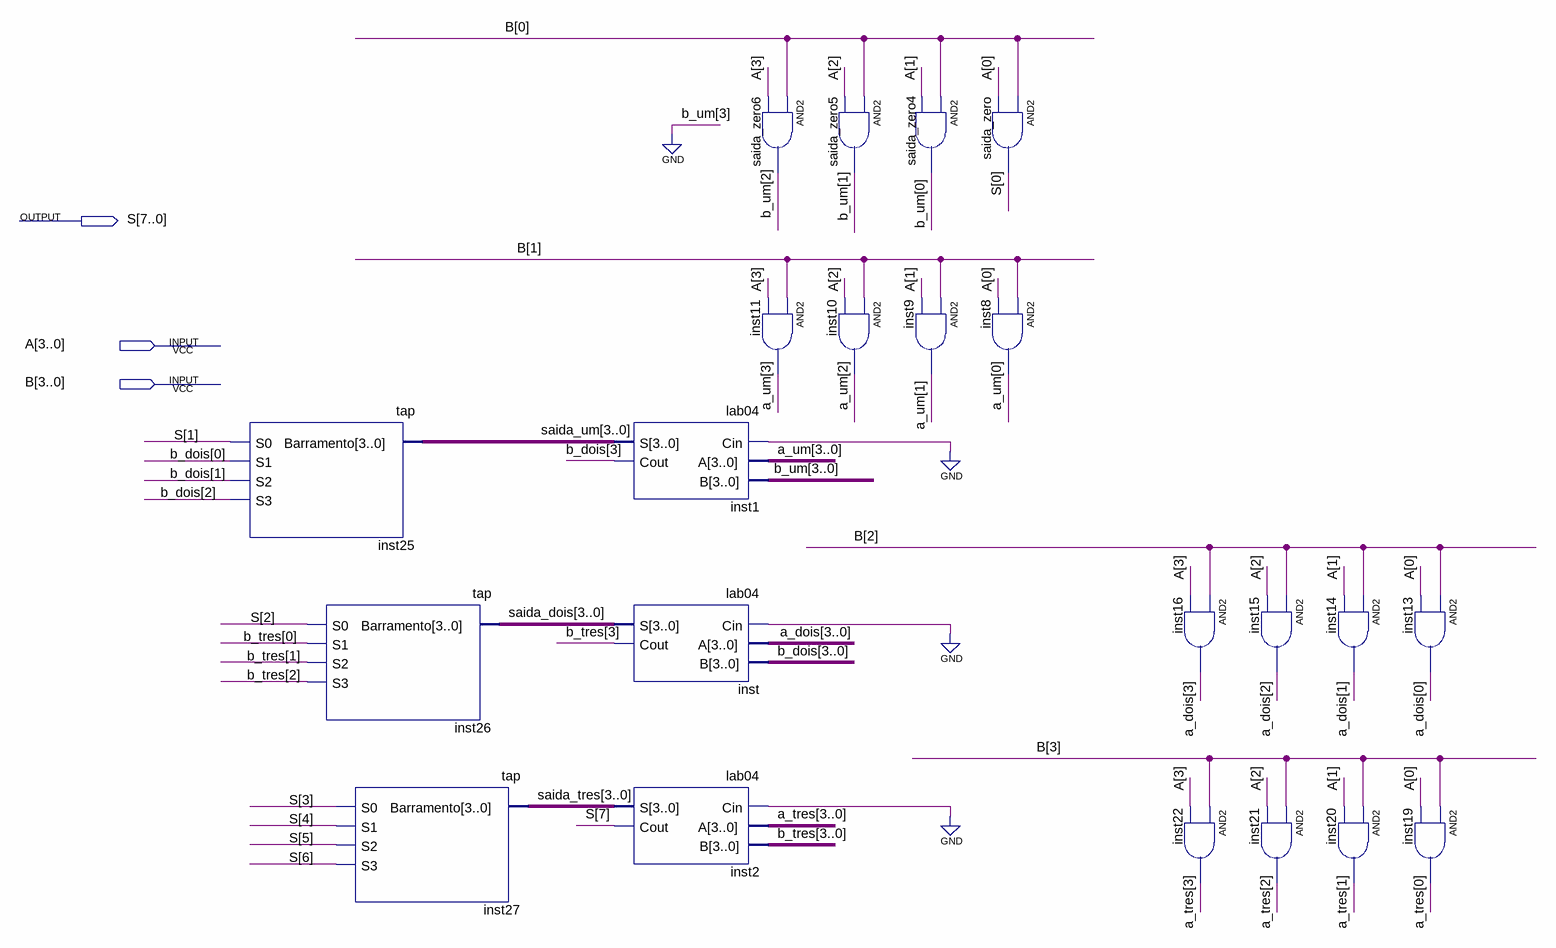
[diagram p0: schematic sheet]
// Quartus schematic mul.bdf as structural Verilog: 22 symbols, 3 pins
module mul (
  input  [3:0] A,
  input  [3:0] B,
  output [7:0] S
);

  wire [2:0] b_um;
  wire [3:0] a_dois, a_tres, a_um, b_dois, b_tres, saida_dois, saida_tres, saida_um;

  tap inst25 (.Barramento(saida_um), .S0(S[1]), .S1(b_dois[0]), .S2(b_dois[1]), .S3(b_dois[2]));
  tap inst26 (.Barramento(saida_dois), .S0(S[2]), .S1(b_tres[0]), .S2(b_tres[1]), .S3(b_tres[2]));
  tap inst27 (.Barramento(saida_tres), .S0(S[3]), .S1(S[4]), .S2(S[5]), .S3(S[6]));
  lab04 inst1 (.Cin(1'b0), .A(a_um), .B({1'b0, b_um}), .S(saida_um), .Cout(b_dois[3]));
  lab04 inst (.Cin(1'b0), .A(a_dois), .B(b_dois), .S(saida_dois), .Cout(b_tres[3]));
  lab04 inst2 (.Cin(1'b0), .A(a_tres), .B(b_tres), .S(saida_tres), .Cout(S[7]));
  and saida_zero6 (b_um[2], B[0], A[3]);
  and inst11 (a_um[3], B[1], A[3]);
  and saida_zero5 (b_um[1], B[0], A[2]);
  and inst10 (a_um[2], B[1], A[2]);
  and saida_zero4 (b_um[0], B[0], A[1]);
  and inst9 (a_um[1], B[1], A[1]);
  and saida_zero (S[0], B[0], A[0]);
  and inst8 (a_um[0], B[1], A[0]);
  and inst16 (a_dois[3], B[2], A[3]);
  and inst22 (a_tres[3], B[3], A[3]);
  and inst15 (a_dois[2], B[2], A[2]);
  and inst21 (a_tres[2], B[3], A[2]);
  and inst14 (a_dois[1], B[2], A[1]);
  and inst20 (a_tres[1], B[3], A[1]);
  and inst13 (a_dois[0], B[2], A[0]);
  and inst19 (a_tres[0], B[3], A[0]);
endmodule
